# EAGLE schematic 188_93_EC_15 (EAGLE 7.6.0)
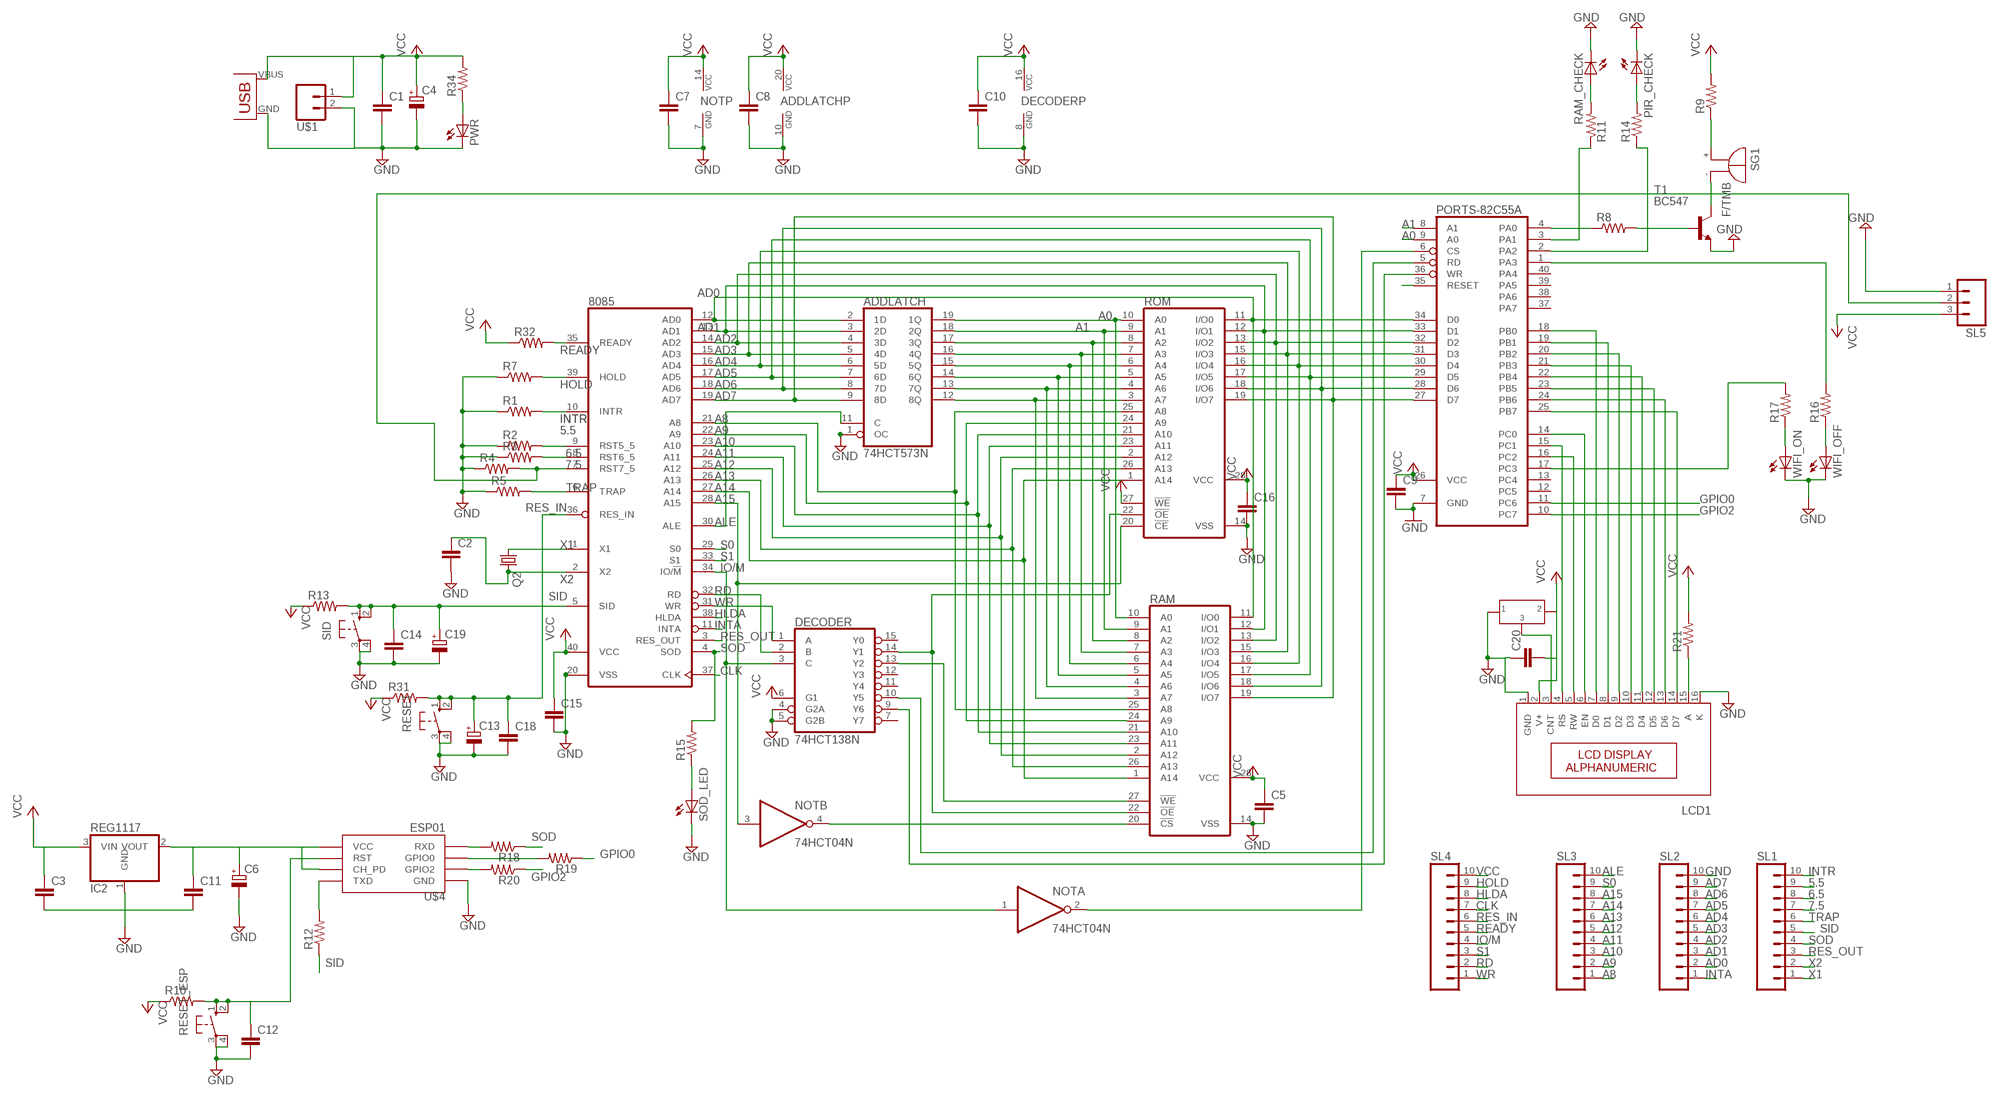
[diagram p0: schematic, sheet 1]

## Parts
8085  8085  [DIL40]
ADDLATCH  74HCT573N  [DIL20]
C1  C-EU025-024X044  [C025-024X044]
C2  C-EU025-024X044  [C025-024X044]
C3  C-EU025-024X044  [C025-024X044]
C4  CPOL-EUE5-8.5  [E5-8,5]
C5  C-EU025-024X044  [C025-024X044]
C6  CPOL-EUE5-8.5  [E5-8,5]
C7  C-EU025-024X044  [C025-024X044]
C8  C-EU025-024X044  [C025-024X044]
C9  C-EU025-024X044  [C025-024X044]
C10  C-EU025-024X044  [C025-024X044]
C11  C-EU025-024X044  [C025-024X044]
C12  C-EU025-024X044  [C025-024X044]
C13  CPOL-EUE5-8.5  [E5-8,5]
C14  C-EU025-024X044  [C025-024X044]
C15  C-EU025-024X044  [C025-024X044]
C16  C-EU025-024X044  [C025-024X044]
C18  C-EU025-024X044  [C025-024X044]
C19  CPOL-EUE5-8.5  [E5-8,5]
C20  C-EU025-024X044  [C025-024X044]
DECODER  74HCT138N  [DIL16]
IC2  REG1117  [SOT223]
LCD1  16X2LCD  [16X2_LCD]
NOT  74HCT04N  [DIL14]
PIR_CHECK  LED5MM  [LED5MM]
PORTS-82C55A  82C55A  [DIL40]
PWR  LED5MM  [LED5MM]
Q2  CRYSTALHC49US  [HC49US]
R1  R-US_0207/7  [0207/7]
R2  R-US_0207/7  [0207/7]
R3  R-US_0207/7  [0207/7]
R4  R-US_0207/7  [0207/7]
R5  R-US_0207/7  [0207/7]
R6  PRESET_LR  [PRESET_LR]
R7  R-US_0207/7  [0207/7]
R8  R-US_0207/7  [0207/7]
R9  R-US_0207/7  [0207/7]
R10  R-US_0207/7  [0207/7]
R11  R-US_0207/7  [0207/7]
R12  R-US_0207/7  [0207/7]
R13  R-US_0207/7  [0207/7]
R14  R-US_0207/7  [0207/7]
R15  R-US_0207/7  [0207/7]
R16  R-US_0207/7  [0207/7]
R17  R-US_0207/7  [0207/7]
R18  R-US_0207/7  [0207/7]
R19  R-US_0207/7  [0207/7]
R20  R-US_0207/7  [0207/7]
R21  R-US_0207/7  [0207/7]
R31  R-US_0207/7  [0207/7]
R32  R-US_0207/7  [0207/7]
R34  R-US_0207/7  [0207/7]
RAM  62256P  [DIL28-6]
RAM_CHECK  LED5MM  [LED5MM]
RESET  10-XX  [B3F-10XX]
RESET_ESP  10-XX  [B3F-10XX]
ROM  58C256P  [DIL28-6]
SG1  F/TMB  [F/TMB]
SID  10-XX  [B3F-10XX]
SL1  M10  [10P]
SL2  M10  [10P]
SL3  M10  [10P]
SL4  M10  [10P]
SL5  M03  [03P]
SOD_LED  LED5MM  [LED5MM]
T1  BC547  [TO92]
U$1  M02  [02P]
U$2  USB(POWER)  [USB(POWER)]
U$4  ESP01  [ESP01]
WIFI_OFF  LED5MM  [LED5MM]
WIFI_ON  LED5MM  [LED5MM]

## Nets
5.5: 8085.9(RST5_5) R2.2 SL1.9
6.5: 8085.8(RST6_5) R3.2 SL1.8
7.5: 8085.7(RST7_5) R4.2 SL1.7 SL5.2
A0: ADDLATCH.19(1Q) PORTS-82C55A.9(A0) RAM.10(A0) ROM.10(A0)
A1: ADDLATCH.18(2Q) PORTS-82C55A.8(A1) RAM.9(A1) ROM.9(A1)
A8: 8085.21(A8) RAM.25(A8) ROM.25(A8) SL3.1
A9: 8085.22(A9) RAM.24(A9) ROM.24(A9) SL3.2
A10: 8085.23(A10) RAM.21(A10) ROM.21(A10) SL3.3
A11: 8085.24(A11) RAM.23(A11) ROM.23(A11) SL3.4
A12: 8085.25(A12) RAM.2(A12) ROM.2(A12) SL3.5
A13: 8085.26(A13) RAM.26(A13) ROM.26(A13) SL3.6
A14: 8085.27(A14) RAM.1(A14) ROM.1(A14) SL3.7
A15: 8085.28(A15) NOT.3(B:I) ROM.20(!CE) SL3.8
AD0: 8085.12(AD0) ADDLATCH.2(1D) PORTS-82C55A.34(D0) RAM.11(I/O0) ROM.11(I/O0) SL2.2
AD1: 8085.13(AD1) ADDLATCH.3(2D) PORTS-82C55A.33(D1) RAM.12(I/O1) ROM.12(I/O1) SL2.3
AD2: 8085.14(AD2) ADDLATCH.4(3D) PORTS-82C55A.32(D2) RAM.13(I/O2) ROM.13(I/O2) SL2.4
AD3: 8085.15(AD3) ADDLATCH.5(4D) PORTS-82C55A.31(D3) RAM.15(I/O3) ROM.15(I/O3) SL2.5
AD4: 8085.16(AD4) ADDLATCH.6(5D) PORTS-82C55A.30(D4) RAM.16(I/O4) ROM.16(I/O4) SL2.6
AD5: 8085.17(AD5) ADDLATCH.7(6D) PORTS-82C55A.29(D5) RAM.17(I/O5) ROM.17(I/O5) SL2.7
AD6: 8085.18(AD6) ADDLATCH.8(7D) PORTS-82C55A.28(D6) RAM.18(I/O6) ROM.18(I/O6) SL2.8
AD7: 8085.19(AD7) ADDLATCH.9(8D) PORTS-82C55A.27(D7) RAM.19(I/O7) ROM.19(I/O7) SL2.9
ALE: 8085.30(ALE) ADDLATCH.11(C) SL3.10
CLK: 8085.37(CLK) SL4.7
GND [GND]: 8085.20(VSS) ADDLATCH.1(OC) ADDLATCH.10(GND) C1.2 C2.2 C3.2 C4.- C5.2 C6.- C7.2 C8.2 C9.2 C10.2 C11.2 C12.2 C13.- C14.2 C15.2 C16.2 C18.2 C19.- C20.1 DECODER.4(G2A) DECODER.5(G2B) DECODER.8(GND) IC2.1(GND) LCD1.1(GND) LCD1.16(K) NOT.7(P:GND) PIR_CHECK.K(C) PORTS-82C55A.7(GND) PWR.K(C) R1.1 R2.1 R3.1 R4.1 R5.1 R6.P$1 R7.1 RAM.14(VSS) RAM_CHECK.K(C) RESET.3(P) RESET.4(P1) RESET_ESP.3(P) RESET_ESP.4(P1) ROM.14(VSS) SID.3(P) SID.4(P1) SL2.10 SL5.1 SOD_LED.K(C) T1.1(E) U$1.2 U$2.GND U$4.GND WIFI_OFF.K(C) WIFI_ON.K(C)
GPIO0: PORTS-82C55A.11(PC6) R19.1
GPIO2: PORTS-82C55A.10(PC7) R20.1
HLDA: 8085.38(HLDA) SL4.8
HOLD: 8085.39(HOLD) R7.2 SL4.9
INTA: 8085.11(INTA) SL2.1
INTR: 8085.10(INTR) R1.2 SL1.10
IO/M: 8085.34(IO/!M) DECODER.3(C) NOT.1(A:I) SL4.4
N$1: R12.2 U$4.TX(TXD)
N$2: R18.2 U$4.RX(RXD)
N$3: R19.2 U$4.GPIO0
N$4: LCD1.15(A) R21.1
N$5: R20.2 U$4.GPIO2
N$6: PORTS-82C55A.17(PC3) R17.2
N$10: PORTS-82C55A.4(PA0) R8.1
N$11: R8.2 T1.2(B)
N$12: ADDLATCH.17(3Q) RAM.8(A2) ROM.8(A2)
N$13: ADDLATCH.16(4Q) RAM.7(A3) ROM.7(A3)
N$14: ADDLATCH.15(5Q) RAM.6(A4) ROM.6(A4)
N$15: ADDLATCH.14(6Q) RAM.5(A5) ROM.5(A5)
N$16: ADDLATCH.13(7Q) RAM.4(A6) ROM.4(A6)
N$17: ADDLATCH.12(8Q) RAM.3(A7) ROM.3(A7)
N$23: LCD1.14(D7) PORTS-82C55A.25(PB7)
N$25: NOT.2(A:O) PORTS-82C55A.6(CS)
N$26: LCD1.4(RS) PORTS-82C55A.15(PC1)
N$28: DECODER.9(Y6) PORTS-82C55A.36(WR)
N$37: LCD1.13(D6) PORTS-82C55A.24(PB6)
N$41: LCD1.5(RW) PORTS-82C55A.16(PC2)
N$43: LCD1.12(D5) PORTS-82C55A.23(PB5)
N$44: PWR.A R34.1
N$45: LCD1.11(D4) PORTS-82C55A.22(PB4)
N$46: LCD1.10(D3) PORTS-82C55A.21(PB3)
N$47: PORTS-82C55A.3(PA1) R11.1
N$48: SG1.- T1.3(C)
N$49: R9.1 SG1.+
N$50: PORTS-82C55A.2(PA2) R14.1
N$51: LCD1.9(D2) PORTS-82C55A.20(PB2)
N$52: LCD1.8(D1) PORTS-82C55A.19(PB1)
N$53: LCD1.7(D0) PORTS-82C55A.18(PB0)
N$54: LCD1.6(EN) PORTS-82C55A.14(PC0)
N$55: LCD1.3(CNT) R6.P$3
N$57: DECODER.14(Y1) RAM.22(!OE) ROM.22(!OE)
N$58: DECODER.13(Y2) RAM.27(!WE)
N$60: NOT.4(B:O) RAM.20(!CS)
N$62: C6.+ C11.1 IC2.2(VOUT) U$4.CH_PD U$4.VCC
N$63 [VCC]: R11.2 RAM_CHECK.A
N$71: PIR_CHECK.A R14.2
N$72: R15.1 SOD_LED.A
N$73: R17.1 WIFI_ON.A
N$74: R16.1 WIFI_OFF.A
N$75: PORTS-82C55A.1(PA3) R16.2
N$80: DECODER.10(Y5) PORTS-82C55A.5(RD)
RD: 8085.32(RD) DECODER.2(B) SL4.2
READY: 8085.35(READY) R32.2 SL4.5
RES_IN: 8085.36(RES_IN) C13.+ C18.1 R31.2 RESET.1(S) RESET.2(S1) SL4.6
RES_IN1: C12.1 R10.2 RESET_ESP.1(S) RESET_ESP.2(S1) U$4.RST
RES_OUT: 8085.3(RES_OUT) PORTS-82C55A.35(RESET) SL1.3
S0: 8085.29(S0) SL3.9
S1: 8085.33(S1) SL4.3
SID: 8085.5(SID) C14.1 C19.+ R12.1 R13.2 SID.1(S) SID.2(S1) SL1.5
SOD: 8085.4(SOD) R15.2 R18.1 SL1.4
TRAP: 8085.6(TRAP) R5.2 SL1.6
VCC [VCC]: 8085.40(VCC) ADDLATCH.20(VCC) C1.1 C3.1 C4.+ C5.1 C7.1 C8.1 C9.1 C10.1 C15.1 C16.1 C20.2 DECODER.6(G1) DECODER.16(VCC) IC2.3(VIN) LCD1.2(V+) NOT.14(P:VCC) PORTS-82C55A.26(VCC) R6.P$2 R9.2 R10.1 R13.1 R21.2 R31.1 R32.1 R34.2 RAM.28(VCC) ROM.27(!WE) ROM.28(VCC) SL4.10 SL5.3 U$1.1 U$2.VBUS(VCC)
WR: 8085.31(WR) DECODER.1(A) SL4.1
X1: 8085.1(X1) Q2.1 SL1.1
X2: 8085.2(X2) C2.1 Q2.2 SL1.2
Unconnected: DECODER.7(Y7) DECODER.11(Y4) DECODER.12(Y3) DECODER.15(Y0) NOT.5(C:I) NOT.6(C:O) NOT.8(D:O) NOT.9(D:I) NOT.10(E:O) NOT.11(E:I) NOT.12(F:O) NOT.13(F:I) PORTS-82C55A.12(PC5) PORTS-82C55A.13(PC4) PORTS-82C55A.37(PA7) PORTS-82C55A.38(PA6) PORTS-82C55A.39(PA5) PORTS-82C55A.40(PA4)

## Library data of the parts
8085 = micro-intel:8085: MICROCOMPUTER/PERIPHERAL DEVICE; OC_FARNELL: unknown; OC_NEWARK: unknown
ADDLATCH = 74xx-eu:74*573: 8-bit D latch BUS DRIVER
C1-C3 C5 C7-C12 C14-C16 C18 C20 = rcl:C-EU: CAPACITOR, European symbol
C4 C6 C13 C19 = rcl:CPOL-EU: POLARIZED CAPACITOR, European symbol
DECODER = 74xx-eu:74*138: 3-line to 8-line DECODER/DEMULTIPLEXER
IC2 = CEDT_JANUARY_2015_v5:REG1117: 800mA and 1A Low Dropout (LDO) Positive Regulator 1.8V, 2.5V, 2.85V, 3.3V, 5V, and Adj
LCD1 = CEDTv81:16X2LCD: ALPHANUMERIC-LCD
NOT = 74xx-eu:74*04: Hex INVERTER
PIR_CHECK PWR RAM_CHECK SOD_LED WIFI_OFF WIFI_ON = CEDTv79:LED
PORTS-82C55A = micro-intel:82C55A: MICROCOMPUTER/PERIPHERAL DEVICE; MF: INTERSIL; MPN: IP82C55AZ; OC_FARNELL: 1562050; OC_NEWARK: 79K6939
Q2 = CEDT:CRYSTAL: Crystals Various standard crystals. Proven footprints. Spark Fun Electronics SKU : COM-00534
R1-R5 R7-R21 R31 R32 R34 = rcl:R-US_: RESISTOR, American symbol
R6 = CEDT_JANUARY_2015:PRESET_LR
RAM = memory-hitachi:62256P: MEMORY; OC_FARNELL: unknown; OC_NEWARK: unknown
RESET RESET_ESP SID = CEDT:10-XX: OMRON SWITCH
ROM = memory-hitachi:58C256P: MEMORY; MPN: HN58C256AP85E; OC_FARNELL: 1496447; OC_NEWARK: 61M6616
SG1 = buzzer:F/TMB: BUZZER Source: Buerklin; OC_FARNELL: unknown; OC_NEWARK: unknown
SL1-SL4 = con-amp-quick:M10: AMP QUICK CONNECTOR; OC_FARNELL: unknown; OC_NEWARK: unknown
SL5 = con-amp-quick:M03: AMP QUICK CONNECTOR; OC_FARNELL: unknown; OC_NEWARK: unknown
T1 = transistor:BC547: NPN TRANSISTOR
U$1 = con-amp-quick:M02: AMP QUICK CONNECTOR; OC_FARNELL: unknown; OC_NEWARK: unknown
U$2 = CEDT_JANUARY_2015_v5:USB(POWER)
U$4 = esp8266modules:ESP01: ESP8266 Wifi module 01

## Net classes
0 default: width 0.406 mm, clearance 0.305 mm
1 VCC: width 0.61 mm, clearance 0.305 mm to class 0, clearance 0.305 mm
2 GND: width 0.61 mm, clearance 0.305 mm to class 0, clearance 0.305 mm to class 1, clearance 0.305 mm